# Altium schematic sheet M2male_miniDP.SchDoc
size A4; SheetNumber: 1; SheetTotal: 1
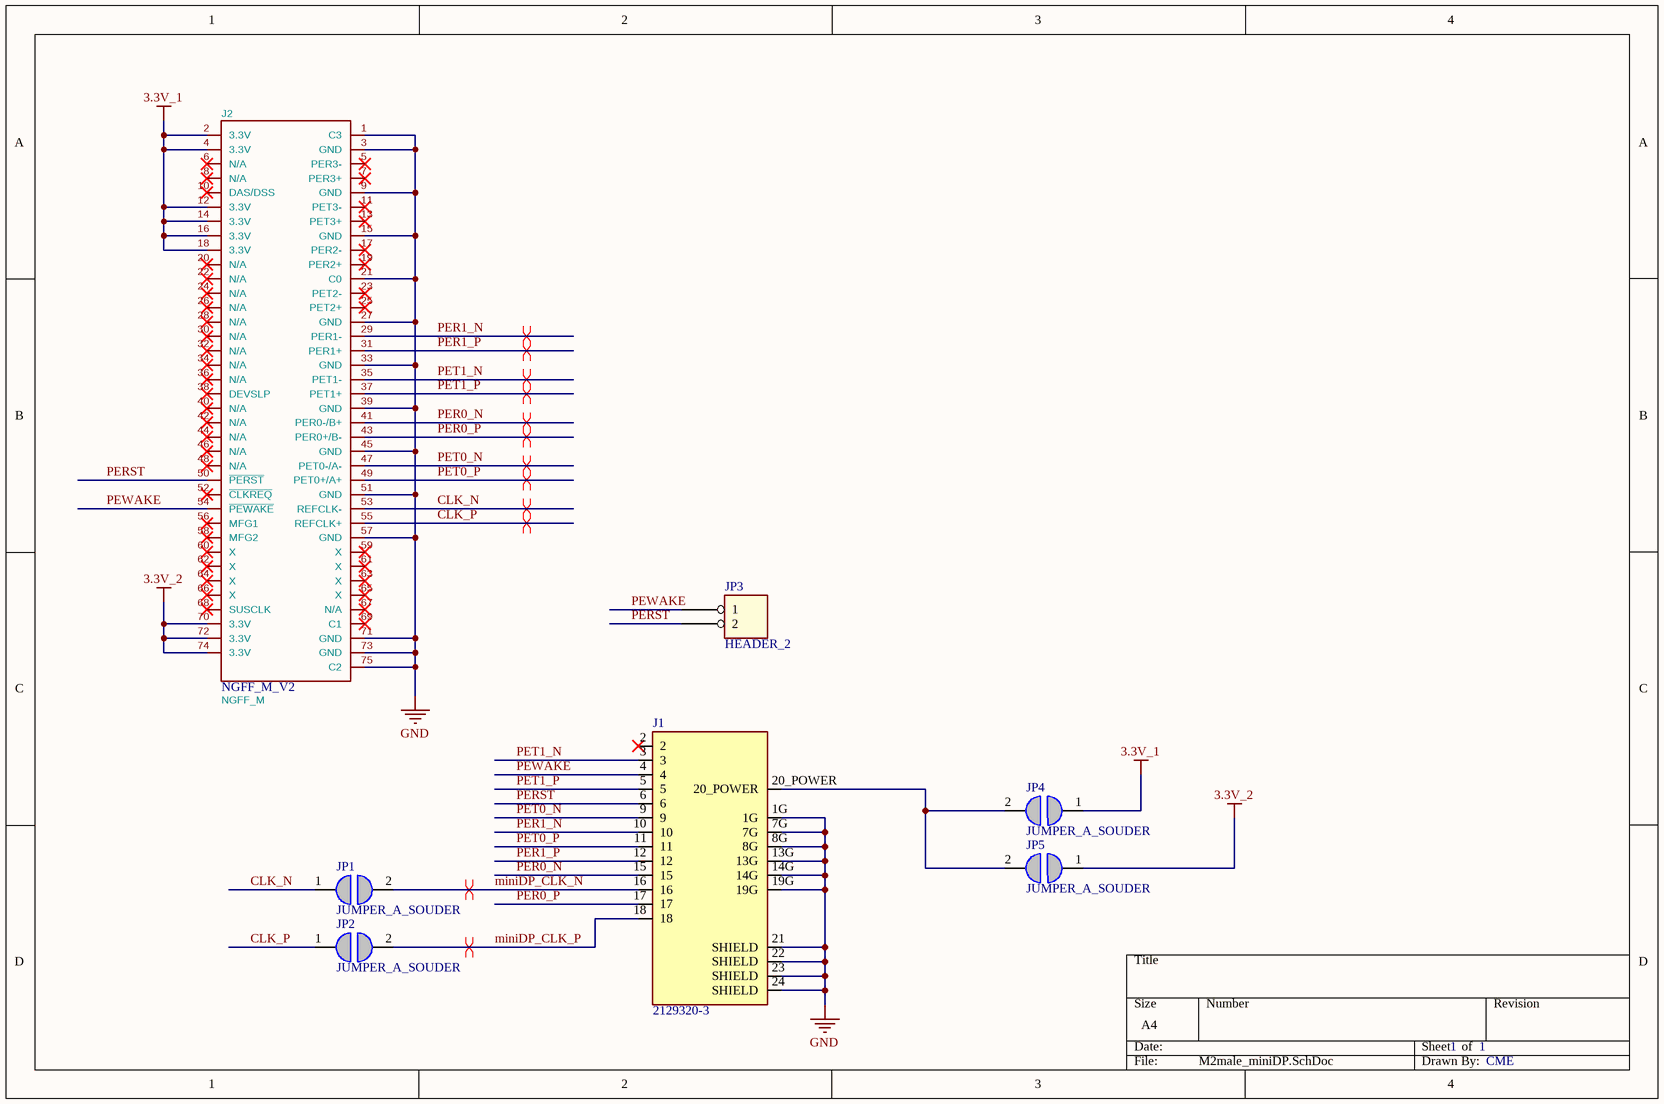
[diagram p0: M2male_miniDP.SchDoc]

## Parts
J1  2129320-3  [CONN_2129320-3]
J2  NGFF_M_V2  value NGFF_M  [M.2-M-KEY-2280-V2]
JP1  JUMPER_A_SOUDER  [JUMPER_A_SOUDER (0201)]
JP2  JUMPER_A_SOUDER  [JUMPER_A_SOUDER (0201)]
JP3  HEADER_2  [Barette simple 2.54mm  2 POLES 90 degres MALE]
JP4  JUMPER_A_SOUDER  [JUMPER_A_SOUDER (0201)]
JP5  JUMPER_A_SOUDER  [JUMPER_A_SOUDER (0201)]

## Nets
3.3V_1: J2.2(3.3V) J2.4(3.3V) J2.12(3.3V) J2.14(3.3V) J2.16(3.3V) J2.18(3.3V) JP4.1
3.3V_2: J2.70(3.3V) J2.72(3.3V) J2.74(3.3V) JP5.1
GND: J1.1G J1.7G J1.8G J1.13G J1.14G J1.19G J1.21(SHIELD) J1.22(SHIELD) J1.23(SHIELD) J1.24(SHIELD) J2.1(C3) J2.3(GND) J2.9(GND) J2.15(GND) J2.21(C0) J2.27(GND) J2.33(GND) J2.39(GND) J2.45(GND) J2.51(GND) J2.57(GND) J2.71(GND) J2.73(GND) J2.75(C2)
CLK_N: J2.53(REFCLK-) JP1.1
CLK_P: J2.55(REFCLK+) JP2.1
miniDP_CLK_N: J1.16 JP1.2
miniDP_CLK_P: J1.18 JP2.2
PER0_N: J1.15 J2.41(PER0-/B+)
PER0_P: J1.17 J2.43(PER0+/B-)
PER1_N: J1.10 J2.29(PER1-)
PER1_P: J1.12 J2.31(PER1+)
PERST: J1.6 J2.50(~{PERST}) JP3.2
PET0_N: J1.9 J2.47(PET0-/A-)
PET0_P: J1.11 J2.49(PET0+/A+)
PET1_N: J1.3 J2.35(PET1-)
PET1_P: J1.5 J2.37(PET1+)
PEWAKE: J1.4 J2.54(~{PEWAKE}) JP3.1
NetJ1_20_POWER: J1.20_POWER JP4.2 JP5.2

Not connected (* = marked no-connect by the designer): J1 2*; J2 5(PER3-)* 6(N/A)* 7(PER3+)* 8(N/A)* 10(DAS/DSS)* 11(PET3-)* 13(PET3+)* 17(PER2-)* 19(PER2+)* 20(N/A)* 22(N/A)* 23(PET2-)* 24(N/A)* 25(PET2+)* 26(N/A)* 28(N/A)* 30(N/A)* 32(N/A)* 34(N/A)* 36(N/A)* 38(DEVSLP)* 40(N/A)* 42(N/A)* 44(N/A)* 46(N/A)* 48(N/A)* 52(~{CLKREQ})* 56(MFG1)* 58(MFG2)* 59(X)* 60(X)* 61(X)* 62(X)* 63(X)* 64(X)* 65(X)* 66(X)* 67(N/A)* 68(SUSCLK)* 69(C1)*

## Layout directives
differential pair: CLK_N, CLK_P, miniDP_CLK_N, miniDP_CLK_P, PER0_N, PER0_P, PER1_N, PER1_P, PET0_N, PET0_P, PET1_N, PET1_P

## Notes on the sheet
- 1
- CME

## Library data of the parts
J1 = 2129320-3: Conn Display Port RCP 20 POS 0.9mm/1.8mm Solder RA Thru-Hole 20 Terminal 1 Port T/R; Number_of_Positions: 20; Product_Type: Connector; MF: TE Connectivity; Centerline_Pitch: .6 mm[.02 in]; Value: *; Digi-Key_Part_Number: A120537CT-ND; Digi-Key_Purchase_URL: https://www.digikey.com/product-detail/en/te-connectivity-amp-connectors/2129320-3/A120537CT-ND/5021748?utm_source=snapeda&utm_medium=aggregator&utm_campaign=symbol; Package: None; SnapEDA_Link: https://www.snapeda.com/parts/2129320-3/TE%20Connectivity%20AMP%20Connectors/view-part/1192429/?ref=snap; TE_purchase_URL: https://www.te.com/usa-en/product-2129320-3.html?te_bu=Cor&te_type=disp&te_campaign=seda_glo_cor-seda-global-disp-prtnr-fy19-seda-model-bom-cta_sma-317_1&elqCampaignId=32493; MP: 2129320-3; EU_RoHS_Compliance: Compliant
JP1 JP2 JP4 JP5 = 683: Pont à souder sur print; ID: 683; Component: Connector; Component Type Category Connector Type: Jumper à souder; Value: 0201; RoHS Compliant: False
JP3 = 421: Barrette mâle 90 degrés 2P 2,54 mm; Manufacturer: TE Connectivity; Manufacturer P/N: 5-826631-0; ID: 421; Component: Connector; Component Type Category Connector Type: Barrette 2.54mm 90 degres; Pitch: 2,54mm; Supplier 1: Distrelec; Supplier Part Number 1: 122359; Supplier 2: Mouser; Supplier Part Number 2: 571-5-826631-0; RoHS Compliant: True; ComponentLink1Description: Datasheet; ComponentLink1URL: http://www.te.com/catalog/pn/en/5-826631-0; ComponentLink2Description: Supplier; ComponentLink2URL: http://www.distrelec.ch/fr/Barrette-%C3%A0-broches-50-p%C3%B4les-1-x50P-TE-Connectivity-5-826631-0/p/14371409?q=122359&page=1&origPos=1&origPageSize=10&simi=99.3